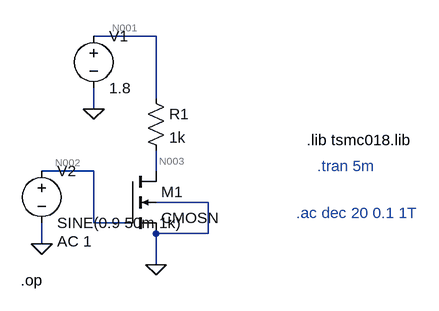
[diagram p0: schematic project1.asc]
project1.asc, the LTspice schematic file:
Version 4.1
SHEET 1 880 680
WIRE 160 -96 64 -96
WIRE 160 0 160 -96
WIRE 64 16 64 -16
WIRE 64 112 -16 112
WIRE 160 112 160 80
WIRE 240 160 160 160
WIRE 64 192 64 112
WIRE 112 192 64 192
WIRE 240 208 240 160
WIRE 240 208 160 208
WIRE -16 224 -16 192
WIRE 160 256 160 208
FLAG 64 16 0
FLAG -16 224 0
FLAG 160 256 0
SYMBOL nmos4 112 112 R0
SYMATTR InstName M1
SYMATTR Value CMOSN
SYMATTR Value2 l=480n w=466n
SYMBOL voltage 64 -112 R0
WINDOW 123 0 0 Left 0
WINDOW 39 0 0 Left 0
SYMATTR InstName V1
SYMATTR Value 1.8
SYMBOL voltage -16 96 R0
WINDOW 123 24 124 Left 2
WINDOW 39 0 0 Left 0
SYMATTR Value2 AC 1
SYMATTR InstName V2
SYMATTR Value SINE(0.9 50m 1k)
SYMBOL res 144 -16 R0
SYMATTR InstName R1
SYMATTR Value 1k
TEXT 392 64 Left 2 !.lib tsmc018.lib
TEXT -48 280 Left 2 !.op
TEXT 408 104 Left 2 ;.tran 5m
TEXT 376 176 Left 2 ;.ac dec 20 0.1 1T

The netlist it stands for:
* project1.asc
M1 N003 N002 0 0 CMOSN l=480n w=466n
V1 N001 0 1.8
V2 N002 0 SINE(0.9 50m 1k) AC 1
R1 N001 N003 1k
.model NMOS NMOS
.model PMOS PMOS
.lib standard.mos
.lib tsmc018.lib
.op
* .tran 5m
* .ac dec 20 0.1 1T
.backanno
.end

* Results of the author's LTspice run, read from the files saved beside the schematic
* Operating Point:
*   V(n002) = 900 mV
*   V(n003) = 1.772 V
*   V(n001) = 1.8 V
*   Id(M1) = 27.77 µA
*   Ig(M1) = 0 A
*   Is(M1) = -27.77 µA
*   Ib(M1) = -1.782 pA
*   I(V2) = 0 A
*   I(V1) = -27.77 µA
*   I(R1) = 27.77 µA
* From the log:
*   Semiconductor Device Operating Points:
*                           --- BSIM3 MOSFETS ---
*   Name:         M1
*   Model:      cmosn
*   Id:        2.78e-05
*   Vgs:       9.00e-01
*   Vds:       1.77e+00
*   Vbs:       0.00e+00
*   Vth:       4.27e-01
*   Vdsat:     2.95e-01
*   Gm:        1.04e-04
*   Gds:       1.04e-06
*   Gmb        2.73e-05
*   Cbd:       0.00e+00
*   Cbs:       0.00e+00
*   Cgsov:     3.84e-16
*   Cgdov:     3.84e-16
*   Cgbov:     4.46e-19
*   dQgdVgb:   2.24e-15
*   dQgdVdb:  -3.76e-16
*   dQgdVsb:  -1.81e-15
*   dQddVgb:  -9.67e-16
*   dQddVdb:   3.80e-16
*   dQddVsb:   7.73e-16
*   dQbdVgb:  -3.10e-16
*   dQbdVdb:   7.49e-19
*   dQbdVsb:  -1.24e-16